# EAGLE schematic LX200V20_test (EAGLE 7.4.0)

## Sheet 1 of 2
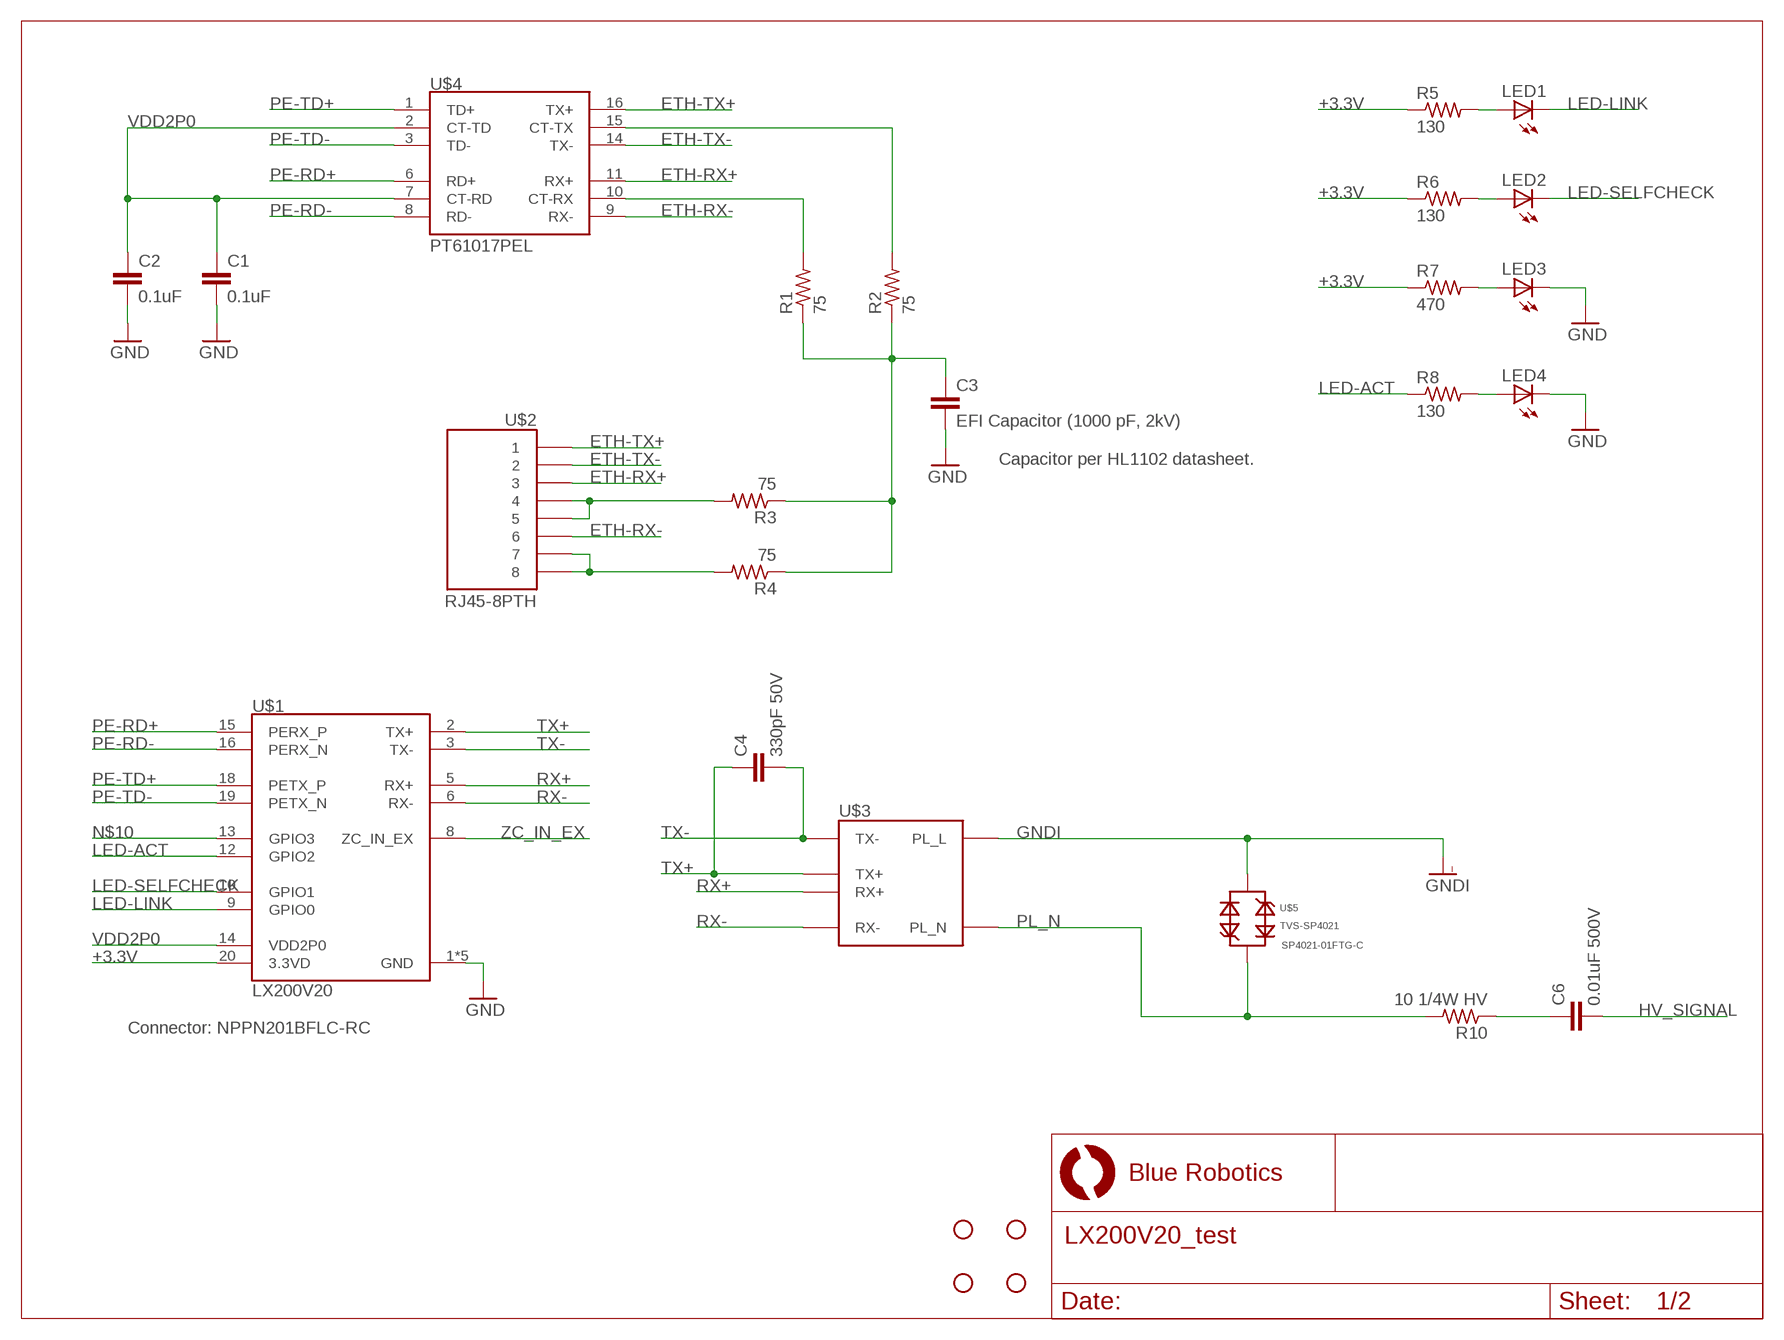
[diagram p0: schematic, sheet 1]

### Parts
C1  0.1uF  C-EUC0402  [C0402]
C2  0.1uF  C-EUC0402  [C0402]
C3  EFI Capacitor (1000 pF, 2kV)  C-EUC1206  [C1206]
C4  330pF 50V  C-EUC0805  [C0805]
C6  0.01uF 500V  C-EUC1206  [C1206]
LED1  LEDCHIPLED_0603  [CHIPLED_0603]
LED2  LEDCHIPLED_0603  [CHIPLED_0603]
LED3  LEDCHIPLED_0603  [CHIPLED_0603]
LED4  LEDCHIPLED_0603  [CHIPLED_0603]
R1  75  R-US_R0603  [R0603]
R2  75  R-US_R0603  [R0603]
R3  75  R-US_R0603  [R0603]
R4  75  R-US_R0603  [R0603]
R5  130  R-US_R0603  [R0603]
R6  130  R-US_R0603  [R0603]
R7  470  R-US_R0603  [R0603]
R8  130  R-US_R0603  [R0603]
R10  10 1/4W HV  R-US_R1206  [R1206]
STANDOFF1  STAND-OFF  [STAND-OFF]
STANDOFF2  STAND-OFF  [STAND-OFF]
STANDOFF3  STAND-OFF  [STAND-OFF]
STANDOFF5  STAND-OFF  [STAND-OFF]
U$1  LX200V20  [LX200V20]
U$2  RJ45-8PTH  [RJ45-8-VERT]
U$3  UT11403S  [UT11403S]
U$4  PT61017PEL  [PT61017PL]
U$5  TVS-SP4021  [SOD323-BIDIRECTIONAL]

### Nets
+3.3V: R5.1 R6.1 R7.1 U$1.20(3.3VD)
ETH-RX+: U$2.3 U$4.11(RX+)
ETH-RX-: U$2.6 U$4.9(RX-)
ETH-TX+: U$2.1 U$4.16(TX+)
ETH-TX-: U$2.2 U$4.14(TX-)
GND: C1.2 C2.2 C3.2 LED3.C LED4.C U$1.1(GND) U$1.4(GND) U$1.7(GND) U$1.11(GND) U$1.17(GND) ; also sheet 2
GNDI: U$3.PL_L U$5.2 ; also sheet 2
HV_SIGNAL: C6.2 ; also sheet 2
LED-ACT: R8.1 U$1.12(GPIO2)
LED-LINK: LED1.C U$1.9(GPIO0)
LED-SELFCHECK: LED2.C U$1.10(GPIO1)
N$1: R1.2 U$4.10(CT-RX)
N$2: R2.2 U$4.15(CT-TX)
N$3: R4.2 U$2.7 U$2.8
N$4: C3.1 R1.1 R2.1 R3.1 R4.1
N$5: R3.2 U$2.4 U$2.5
N$6: LED1.A R5.2
N$7: LED2.A R6.2
N$8: LED3.A R7.2
N$9: LED4.A R8.2
N$10: U$1.13(GPIO3)
N$11: C6.1 R10.1
PE-RD+: U$1.15(PERX_P) U$4.6(RD+)
PE-RD-: U$1.16(PERX_N) U$4.8(RD-)
PE-TD+: U$1.18(PETX_P) U$4.1(TD+)
PE-TD-: U$1.19(PETX_N) U$4.3(TD-)
PL_N: R10.2 U$3.PL_N U$5.1
RX+: U$1.5(RX+) U$3.RX+
RX-: U$1.6(RX-) U$3.RX-
TX+: C4.1 U$1.2(TX+) U$3.TX+
TX-: C4.2 U$1.3(TX-) U$3.TX-
VDD2P0: C1.1 C2.1 U$1.14(VDD2P0) U$4.2(CT-TD) U$4.7(CT-RD)
ZC_IN_EX: U$1.8(ZC_IN_EX)

### Notes on the sheet
- Capacitor per HL1102 datasheet.
- SP4021-01FTG-C
- Connector: NPPN201BFLC-RC

## Sheet 2 of 2
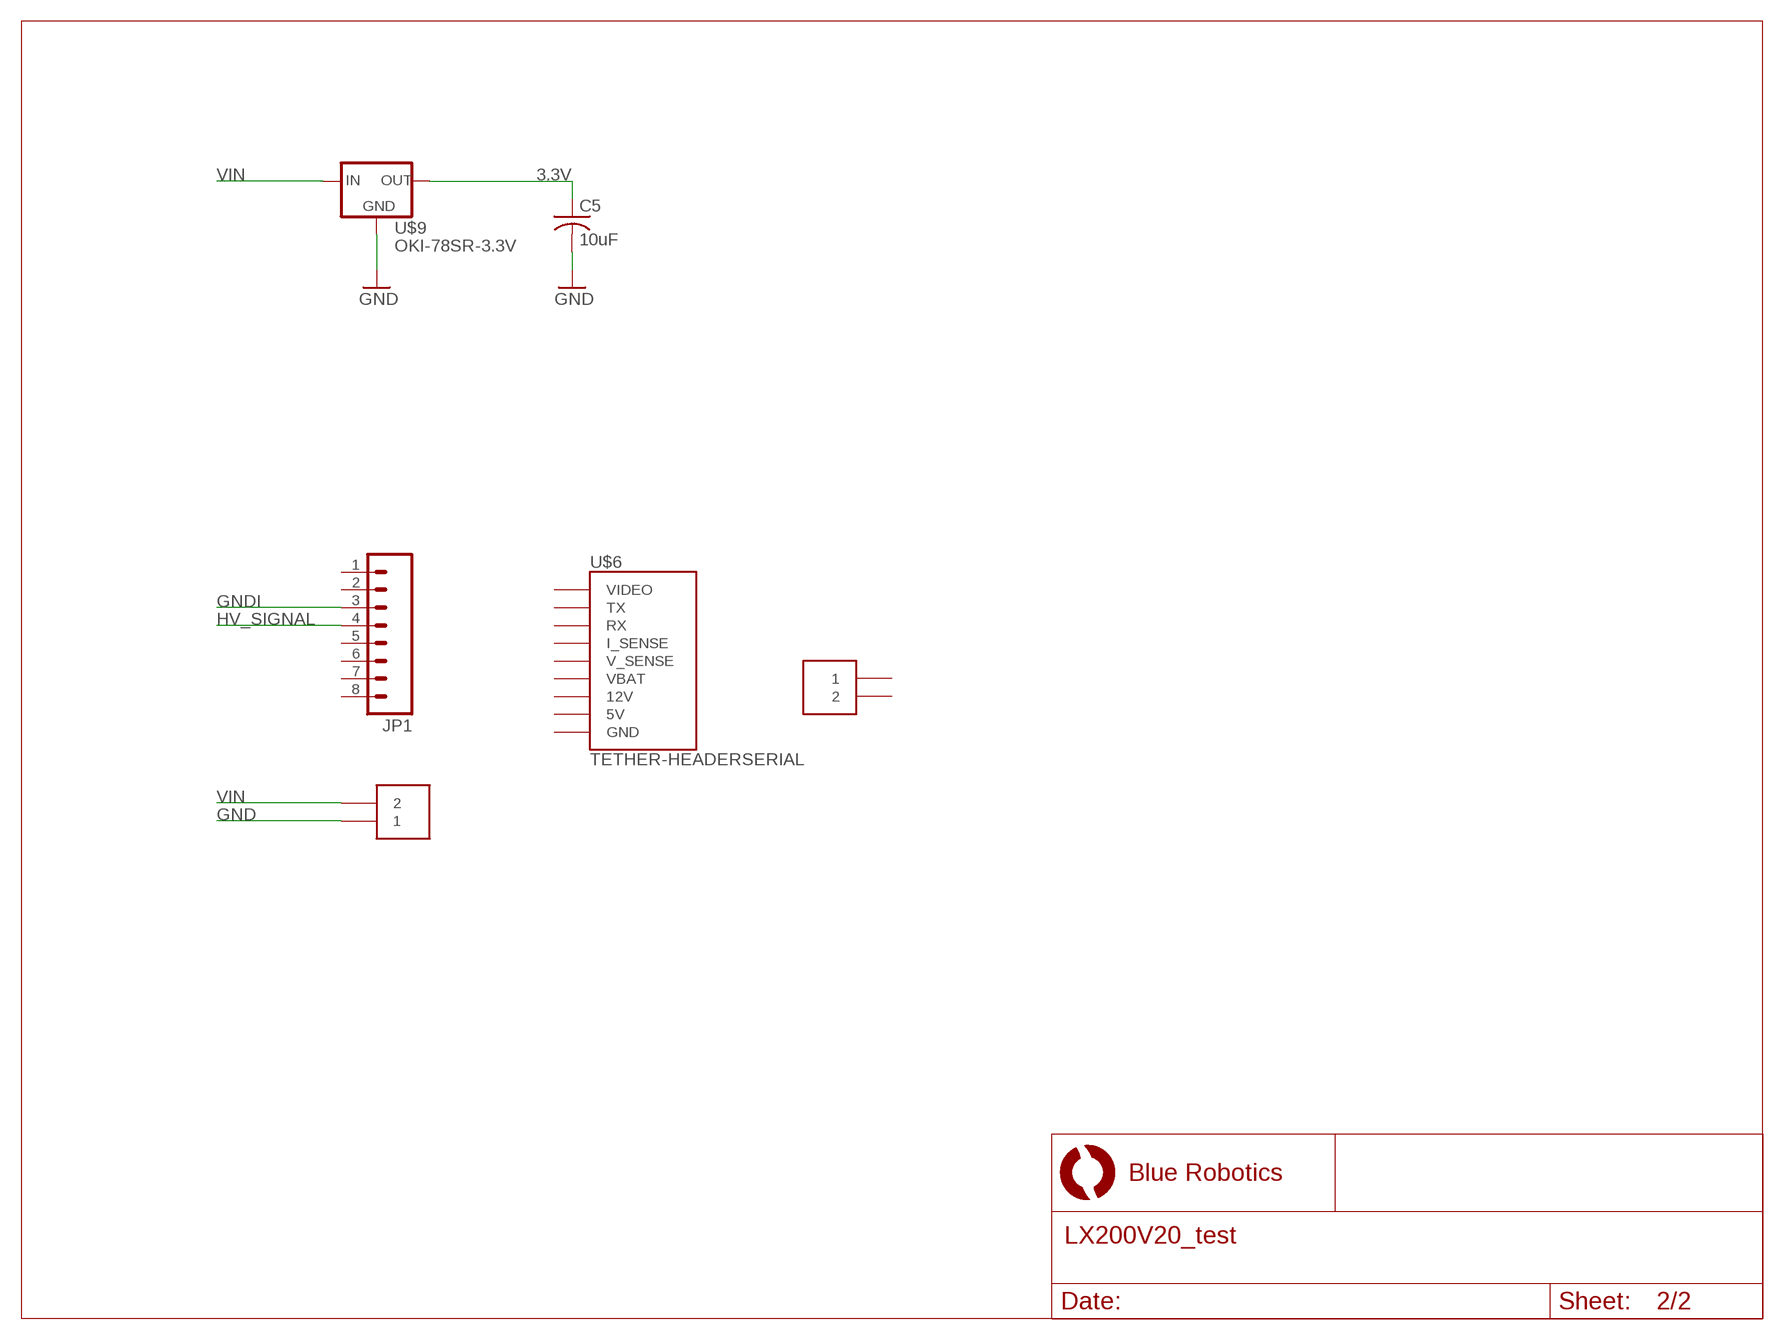
[diagram p1: schematic, sheet 2]

### Parts
C5  10uF  C-USC1206  [C1206]
JP1  M083.5MM-8  [SCREWTERMINAL-3.5MM-8]
U$6  TETHER-HEADERSERIAL  [TETHER-HEADER-2X7]
U$7  HEADER-2POWER  [TETHER-POWER-TERMINALS]
U$8  HEADER-2POWER  [TETHER-POWER-TERMINALS]
U$9  OKI-78SR-3.3V  VREG-OKI-78SR  [OKI-78SR]

### Nets
3.3V: C5.1 U$9.OUTPUT(OUT)
GND: C5.2 U$7.1A U$7.1B U$9.GND ; also sheet 1
GNDI: JP1.3 ; also sheet 1
HV_SIGNAL: JP1.4 ; also sheet 1
VIN: U$7.2A U$7.2B U$9.INPUT(IN)
Unconnected: JP1.1 JP1.2 JP1.5 JP1.6 JP1.7 JP1.8 U$6.5V U$6.12V U$6.GND0(GND) U$6.GND1(GND) U$6.GND2(GND) U$6.I_SENSE U$6.RX U$6.TX U$6.V_SENSE U$6.VBAT U$6.VIDEO U$8.1A U$8.1B U$8.2A U$8.2B

## Library data of the parts
C1-C4 C6 = resistor:C-EU: CAPACITOR, European symbol
C5 = resistor:C-US: CAPACITOR, American symbol
JP1 = SparkFun-Connectors:M08: Header 8 Standard 8-pin 0.1" header. Use with straight break away headers (SKU : PRT-00116), right angle break away headers (PRT-00553), swiss pins (PRT-00743), machine pins (PRT-00117), and female headers (PRT-00115).
LED1-LED4 = led:LED: LED OSRAM: - CHIPLED LG R971, LG N971, LY N971, LG Q971, LY Q971, LO R971, LY R971 LH N974, LH R974 LS Q976, LO Q976, LY Q976 LO Q996 - Hyper CHIPLED LW Q18S LB Q993, LB Q99A, LB R99A - SideLED LS A670, LO A670, LY A670, LG A670, LP A670 LB A673, LV A673, LT A673, LW A673 LH A674 LY A675 LS A676, LA A676, LO A676, LY A676, LW A676 LS A679, LY A679, LG A679 - Hyper Micro SIDELED® LS Y876, LA Y876, LO Y876, LY Y876 LT Y87S - SmartLED LW L88C, LW L88S LB L89C, LB L89S, LG L890 LS L89K, LO L89K, LY L89K LS L896, LA L896, LO L896, LY L896 - TOPLED LS T670, LO T670, LY T670, LG T670, LP T670 LSG T670, LSP T670, LSY T670, LOP T670, LYG T670 LG T671, LOG T671, LSG T671 LB T673, LV T673, LT T673, LW T673 LH T674 LS T676, LA T676, LO T676, LY T676, LB T676, LH T676, LSB T676, LW T676 LB T67C, LV T67C, LT T67C, LS T67K, LO T67K, LY T67K, LW E67C LS E67B, LA E67B, LO E67B, LY E67B, LB E67C, LV E67C, LT E67C LW T67C LS T679, LY T679, LG T679 LS T770, LO T770, LY T770, LG T770, LP T770 LB T773, LV T773, LT T773, LW T773 LH T774 LS E675, LA E675, LY E675, LS T675 LS T776, LA T776, LO T776, LY T776, LB T776 LHGB T686 LT T68C, LB T68C - Hyper Mini TOPLED® LB M676 - Mini TOPLED Santana® LG M470 LS M47K, LO M47K, LY M47K Source: http://www.osram.convergy.de LUXEON: - LUMILED® LXK2-PW12-R00, LXK2-PW12-S00, LXK2-PW14-U00, LXK2-PW14-V00 LXK2-PM12-R00, LXK2-PM12-S00, LXK2-PM14-U00 LXK2-PE12-Q00, LXK2-PE12-R00, LXK2-PE12-S00, LXK2-PE14-T00, LXK2-PE14-U00 LXK2-PB12-K00, LXK2-PB12-L00, LXK2-PB12-M00, LXK2-PB14-N00, LXK2-PB14-P00, LXK2-PB14-Q00 LXK2-PR12-L00, LXK2-PR12-M00, LXK2-PR14-Q00, LXK2-PR14-R00 LXK2-PD12-Q00, LXK2-PD12-R00, LXK2-PD12-S00 LXK2-PH12-R00, LXK2-PH12-S00 LXK2-PL12-P00, LXK2-PL12-Q00, LXK2-PL12-R00 Source: www.luxeon.com KINGBRIGHT: KA-3528ASYC Source: www.kingbright.com
R1-R8 R10 = resistor:R-US_: RESISTOR, American symbol
STANDOFF1-STANDOFF3 STANDOFF5 = SparkFun-Electromechanical:STAND-OFF: #4 Stand Off This is the mechanical footprint for a #4 phillips button head screw. Use the keepout ring to avoid running the screw head into surrounding components. SKU : PRT-00447
U$1 = BR-Eagle-Library:LX200V20
U$2 = BlueRobotics-Main:RJ45-8: RJ45 Jack Simple RJ45, 8-pin connection - connector for common Cat5, Cat5e, and Cat6 Ethernet cables. Footprint not yet proven in production. Connector sku is PRT-00643; Breakout PCB sku is BOB-00716.
U$3 = BlueRobotics-Main:UT11403S
U$4 = BlueRobotics-Main:PT61017PEL
U$5 = BlueRobotics-Main:TVS-SP4021
U$6 = BlueRobotics-Main:TETHER-HEADER
U$7 U$8 = BlueRobotics-Main:HEADER-2
U$9 = BlueRobotics-Main:VREG-OKI-78SR